# EAGLE design DC27-top (EAGLE 9.4.1)
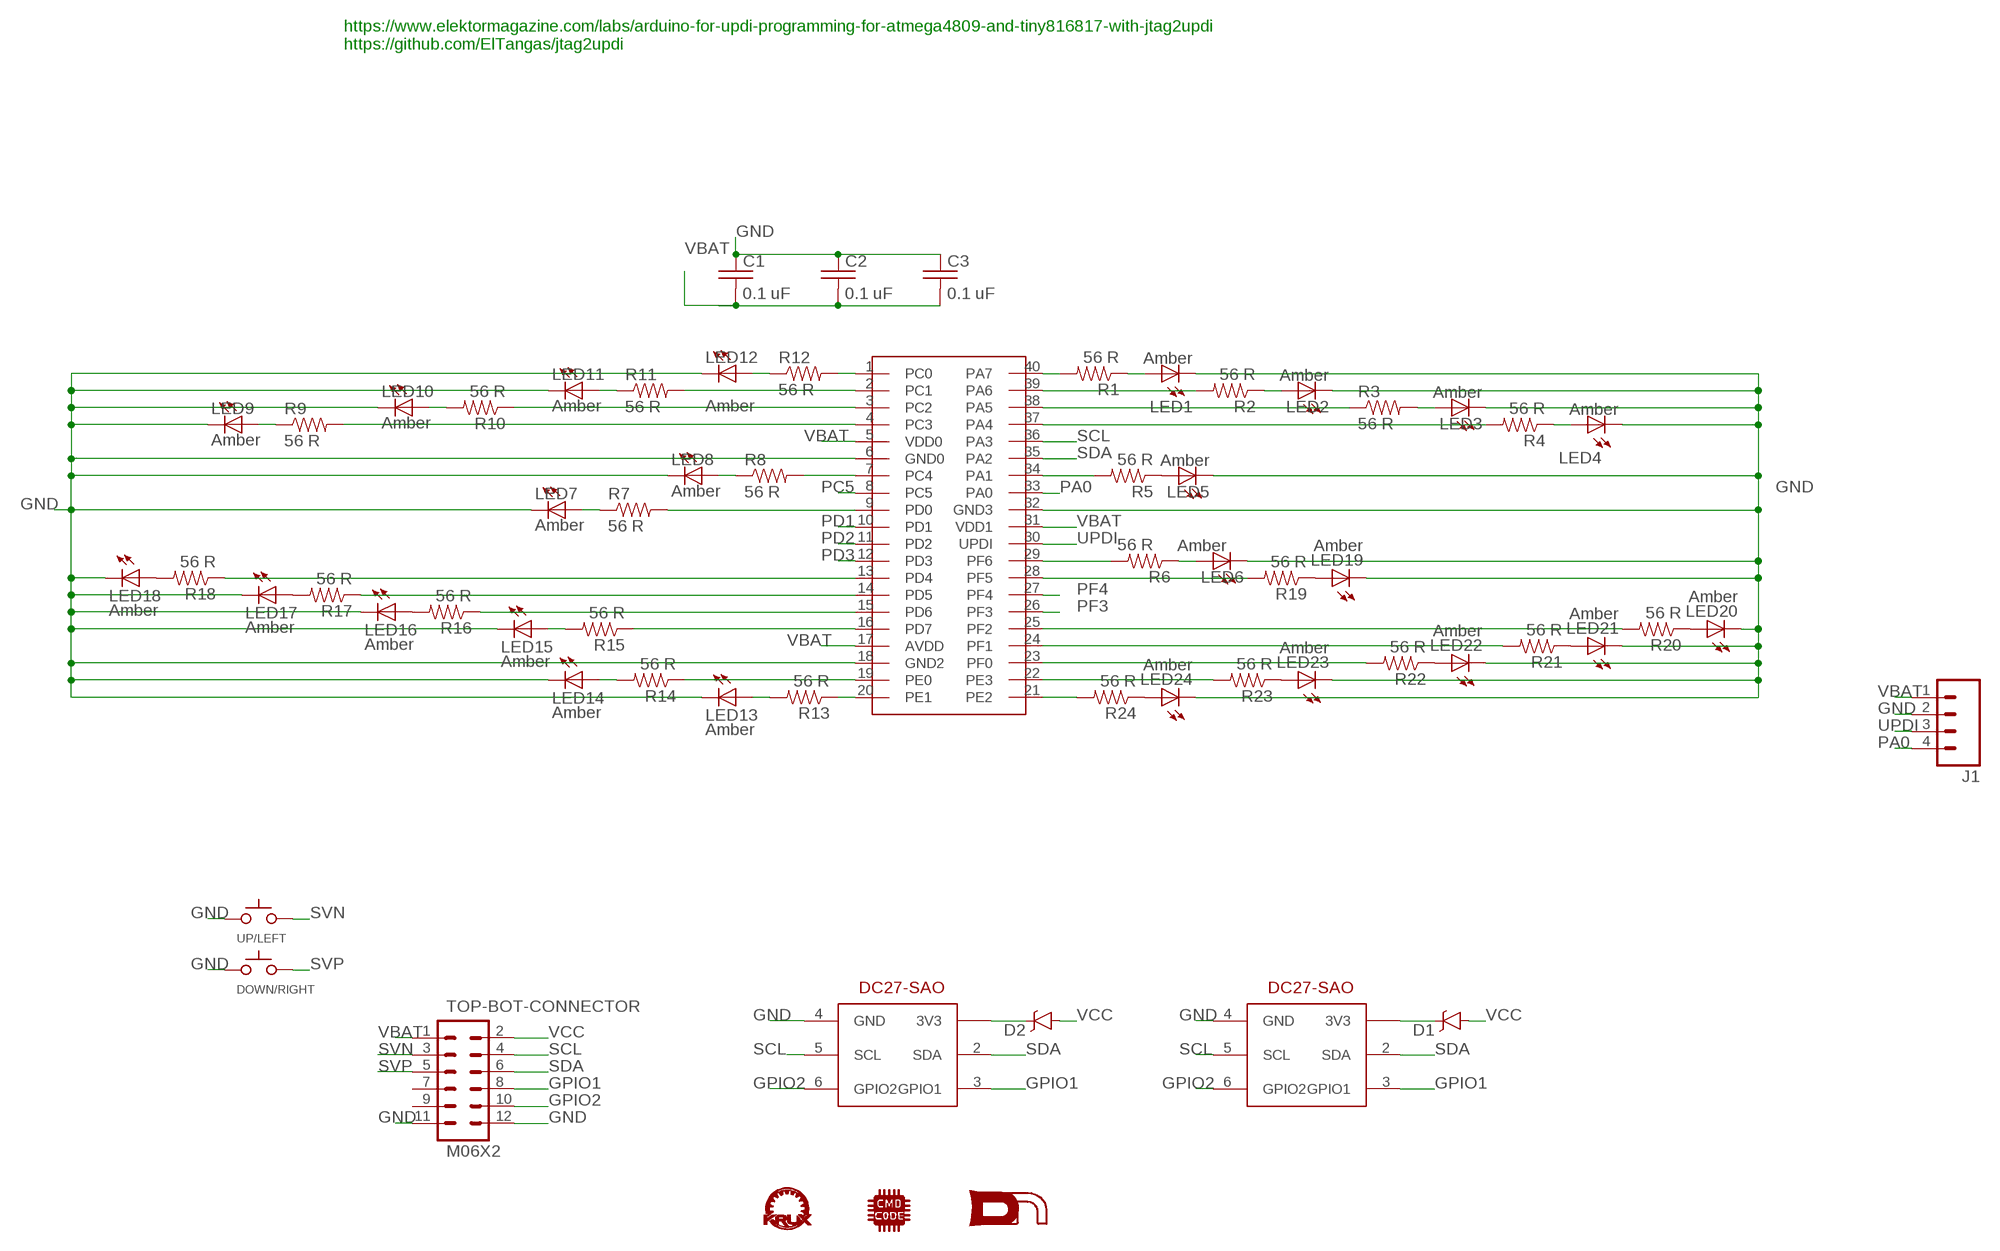
[diagram p0: schematic, sheet 1]

## Parts
C1  0.1 uF  C-USC1206  [C1206]
C2  0.1 uF  C-USC1206  [C1206]
C3  0.1 uF  C-USC1206  [C1206]
D1  DIODE-SCHOTTKYDIOAD-TH  [DIOAD1060W80L520D270]
D2  DIODE-SCHOTTKYDIOAD-TH  [DIOAD1060W80L520D270]
DOWN/RIGHT  SWITCH_TACTILETACTILE-2PIN-NARROW  [TACTILE-2PIN-NARROW]
J1  M04PTH  [1X04]
LED1  Amber  LEDREVERSEMOUNT  [GULLWING_LED]
LED2  Amber  LEDREVERSEMOUNT  [GULLWING_LED]
LED3  Amber  LEDREVERSEMOUNT  [GULLWING_LED]
LED4  Amber  LEDREVERSEMOUNT  [GULLWING_LED]
LED5  Amber  LEDREVERSEMOUNT  [GULLWING_LED]
LED6  Amber  LEDREVERSEMOUNT  [GULLWING_LED]
LED7  Amber  LEDREVERSEMOUNT  [GULLWING_LED]
LED8  Amber  LEDREVERSEMOUNT  [GULLWING_LED]
LED9  Amber  LEDREVERSEMOUNT  [GULLWING_LED]
LED10  Amber  LEDREVERSEMOUNT  [GULLWING_LED]
LED11  Amber  LEDREVERSEMOUNT  [GULLWING_LED]
LED12  Amber  LEDREVERSEMOUNT  [GULLWING_LED]
LED13  Amber  LEDREVERSEMOUNT  [GULLWING_LED]
LED14  Amber  LEDREVERSEMOUNT  [GULLWING_LED]
LED15  Amber  LEDREVERSEMOUNT  [GULLWING_LED]
LED16  Amber  LEDREVERSEMOUNT  [GULLWING_LED]
LED17  Amber  LEDREVERSEMOUNT  [GULLWING_LED]
LED18  Amber  LEDREVERSEMOUNT  [GULLWING_LED]
LED19  Amber  LEDREVERSEMOUNT  [GULLWING_LED]
LED20  Amber  LEDREVERSEMOUNT  [GULLWING_LED]
LED21  Amber  LEDREVERSEMOUNT  [GULLWING_LED]
LED22  Amber  LEDREVERSEMOUNT  [GULLWING_LED]
LED23  Amber  LEDREVERSEMOUNT  [GULLWING_LED]
LED24  Amber  LEDREVERSEMOUNT  [GULLWING_LED]
R1  56 R  RESISTOR1206  [1206]
R2  56 R  RESISTOR1206  [1206]
R3  56 R  RESISTOR1206  [1206]
R4  56 R  RESISTOR1206  [1206]
R5  56 R  RESISTOR1206  [1206]
R6  56 R  RESISTOR1206  [1206]
R7  56 R  RESISTOR1206  [1206]
R8  56 R  RESISTOR1206  [1206]
R9  56 R  RESISTOR1206  [1206]
R10  56 R  RESISTOR1206  [1206]
R11  56 R  RESISTOR1206  [1206]
R12  56 R  RESISTOR1206  [1206]
R13  56 R  RESISTOR1206  [1206]
R14  56 R  RESISTOR1206  [1206]
R15  56 R  RESISTOR1206  [1206]
R16  56 R  RESISTOR1206  [1206]
R17  56 R  RESISTOR1206  [1206]
R18  56 R  RESISTOR1206  [1206]
R19  56 R  RESISTOR1206  [1206]
R20  56 R  RESISTOR1206  [1206]
R21  56 R  RESISTOR1206  [1206]
R22  56 R  RESISTOR1206  [1206]
R23  56 R  RESISTOR1206  [1206]
R24  56 R  RESISTOR1206  [1206]
TOP-BOT-CONNECTOR  M06X2  [2X6]
U$1  KRUX_LOGO  [KRUX_LOGO]
U$2  CMD_C0DE_LOGO  [CMD_C0DE_LOGO]
U$3  DC-27-SAO  [3X2]
U$4  DC-27-SAO  [3X2]
U$5  DN_LOGODC26  [DN_LOGO_DC26]
U$6  ATMEGA4809-PFATMEL4809-PF  [DIP1587W58P254L5175H635Q40B]
UP/LEFT  SWITCH_TACTILETACTILE-2PIN-NARROW  [TACTILE-2PIN-NARROW]

## Nets
GND: C1.1 C2.1 C3.1 DOWN/RIGHT.P$2(C) J1.2 LED1.C LED2.C LED3.C LED4.C LED5.C LED6.C LED7.C LED8.C LED9.C LED10.C LED11.C LED12.C LED13.C LED14.C LED15.C LED16.C LED17.C LED18.C LED19.C LED20.C LED21.C LED22.C LED23.C LED24.C TOP-BOT-CONNECTOR.11 TOP-BOT-CONNECTOR.12 U$3.4(GND) U$4.4(GND) U$6.6(GND0) U$6.18(GND2) U$6.32(GND3) UP/LEFT.P$2(C)
GPIO1: TOP-BOT-CONNECTOR.8 U$3.3(GPIO1) U$4.3(GPIO1)
GPIO2: TOP-BOT-CONNECTOR.10 U$3.6(GPIO2) U$4.6(GPIO2)
N$1: R9.2 U$6.4(PC3)
N$2: LED9.A R9.1
N$3: R8.2 U$6.7(PC4)
N$4: R7.2 U$6.9(PD0)
N$5: R1.2 U$6.40(PA7)
N$6: R2.2 U$6.39(PA6)
N$7: R3.1 U$6.38(PA5)
N$8: LED8.A R8.1
N$9: LED7.A R7.1
N$10: R10.1 U$6.3(PC2)
N$11: R11.2 U$6.2(PC1)
N$12: R12.2 U$6.1(PC0)
N$13: R4.2 U$6.37(PA4)
N$14: LED5.A R5.1
N$15: R5.2 U$6.34(PA1)
N$16: R13.1 U$6.20(PE1)
N$17: LED13.A R13.2
N$18: R14.1 U$6.19(PE0)
N$19: LED14.A R14.2
N$20: R15.1 U$6.16(PD7)
N$21: LED15.A R15.2
N$22: LED17.A R17.2
N$23: LED16.A R16.2
N$24: R18.1 U$6.13(PD4)
N$25: D2.C U$3.1(3V3)
N$26: D1.C U$4.1(3V3)
N$27: R6.2 U$6.29(PF6)
N$28: LED6.A R6.1
N$29: LED4.A R4.1
N$30: LED18.A R18.2
N$31: LED1.A R1.1
N$32: LED2.A R2.1
N$33: R17.1 U$6.14(PD5)
N$34: R16.1 U$6.15(PD6)
N$35: LED24.A R24.1
N$36: LED10.A R10.2
N$37: LED11.A R11.1
N$38: LED12.A R12.1
N$39: LED23.A R23.1
N$40: LED22.A R22.1
N$41: LED19.A R19.1
N$42: LED21.A R21.1
N$43: LED20.A R20.1
N$44: R19.2 U$6.28(PF5)
N$45: R20.2 U$6.25(PF2)
N$46: R21.2 U$6.24(PF1)
N$47: R22.2 U$6.23(PF0)
N$48: R23.2 U$6.22(PE3)
N$49: R24.2 U$6.21(PE2)
N$51: LED3.A R3.2
PA0: J1.4 U$6.33(PA0)
PC5: U$6.8(PC5)
PD1: U$6.10(PD1)
PD2: U$6.11(PD2)
PD3: U$6.12(PD3)
PF3: U$6.26(PF3)
PF4: U$6.27(PF4)
SCL: TOP-BOT-CONNECTOR.4 U$3.5(SCL) U$4.5(SCL) U$6.36(PA3)
SDA: TOP-BOT-CONNECTOR.6 U$3.2(SDA) U$4.2(SDA) U$6.35(PA2)
SVN: TOP-BOT-CONNECTOR.3 UP/LEFT.P$1(A)
SVP: DOWN/RIGHT.P$1(A) TOP-BOT-CONNECTOR.5
UPDI: J1.3 U$6.30(UPDI)
VBAT [5v]: C1.2 C2.2 C3.2 J1.1 TOP-BOT-CONNECTOR.1 U$6.5(VDD0) U$6.17(AVDD) U$6.31(VDD1)
VCC [vcc]: D1.A D2.A TOP-BOT-CONNECTOR.2
Unconnected: TOP-BOT-CONNECTOR.7 TOP-BOT-CONNECTOR.9

## Notes on the sheet
- https://www.elektormagazine.com/labs/arduino-for-updi-programming-for-atmega4809-and-tiny816817-with-jtag2updi
  https://github.com/ElTangas/jtag2updi

## Library data of the parts
C1-C3 = passives:C-US: CAPACITOR, American symbol
D1 D2 = passives:DIODE-SCHOTTKY
DOWN/RIGHT UP/LEFT = switches:SWITCH_TACTILE
J1 = connector:M04: Header 4 Standard 4-pin 0.1" header. Use with straight break away headers (SKU : PRT-00116), right angle break away headers (PRT-00553), swiss pins (PRT-00743), machine pins (PRT-00117), and female headers (PRT-00115). Molex polarized connector foot print use with SKU : PRT-08231 with associated crimp pins and housings. 1MM SMD Version SKU: PRT-10208; PROD_ID: CONN-09696
LED1-LED24 = leds:LED: LEDs Standard schematic elements and footprints for 5mm, 3mm, 1206, and 0603 sized LEDs. 5mm - Spark Fun Electronics SKU : COM-00529 (and others)
R1-R24 = passives:RESISTOR: Resistor Basic schematic elements and footprints for 0603, 1206, and PTH resistors.
TOP-BOT-CONNECTOR = connector:M06X2
U$1 = darknet_parts_library:KRUX_LOGO
U$2 = logos:CMD_C0DE_LOGO
U$3 U$4 = defcon:DC-27-SAO: DC27SAO device
U$5 = darknet_parts_library:DN_LOGO
U$6 = ICs:ATMEGA4809-PF: datasheet <https://www.microchip.com/wwwproducts/en/ATMEGA4809#datasheet-toggle>

## Net classes
1 vcc: width 0.203 mm, drill 0.8 mm, clearance 0.178 mm
2 5v: width 0.254 mm, drill 0.8 mm, clearance 0.178 mm

## Board
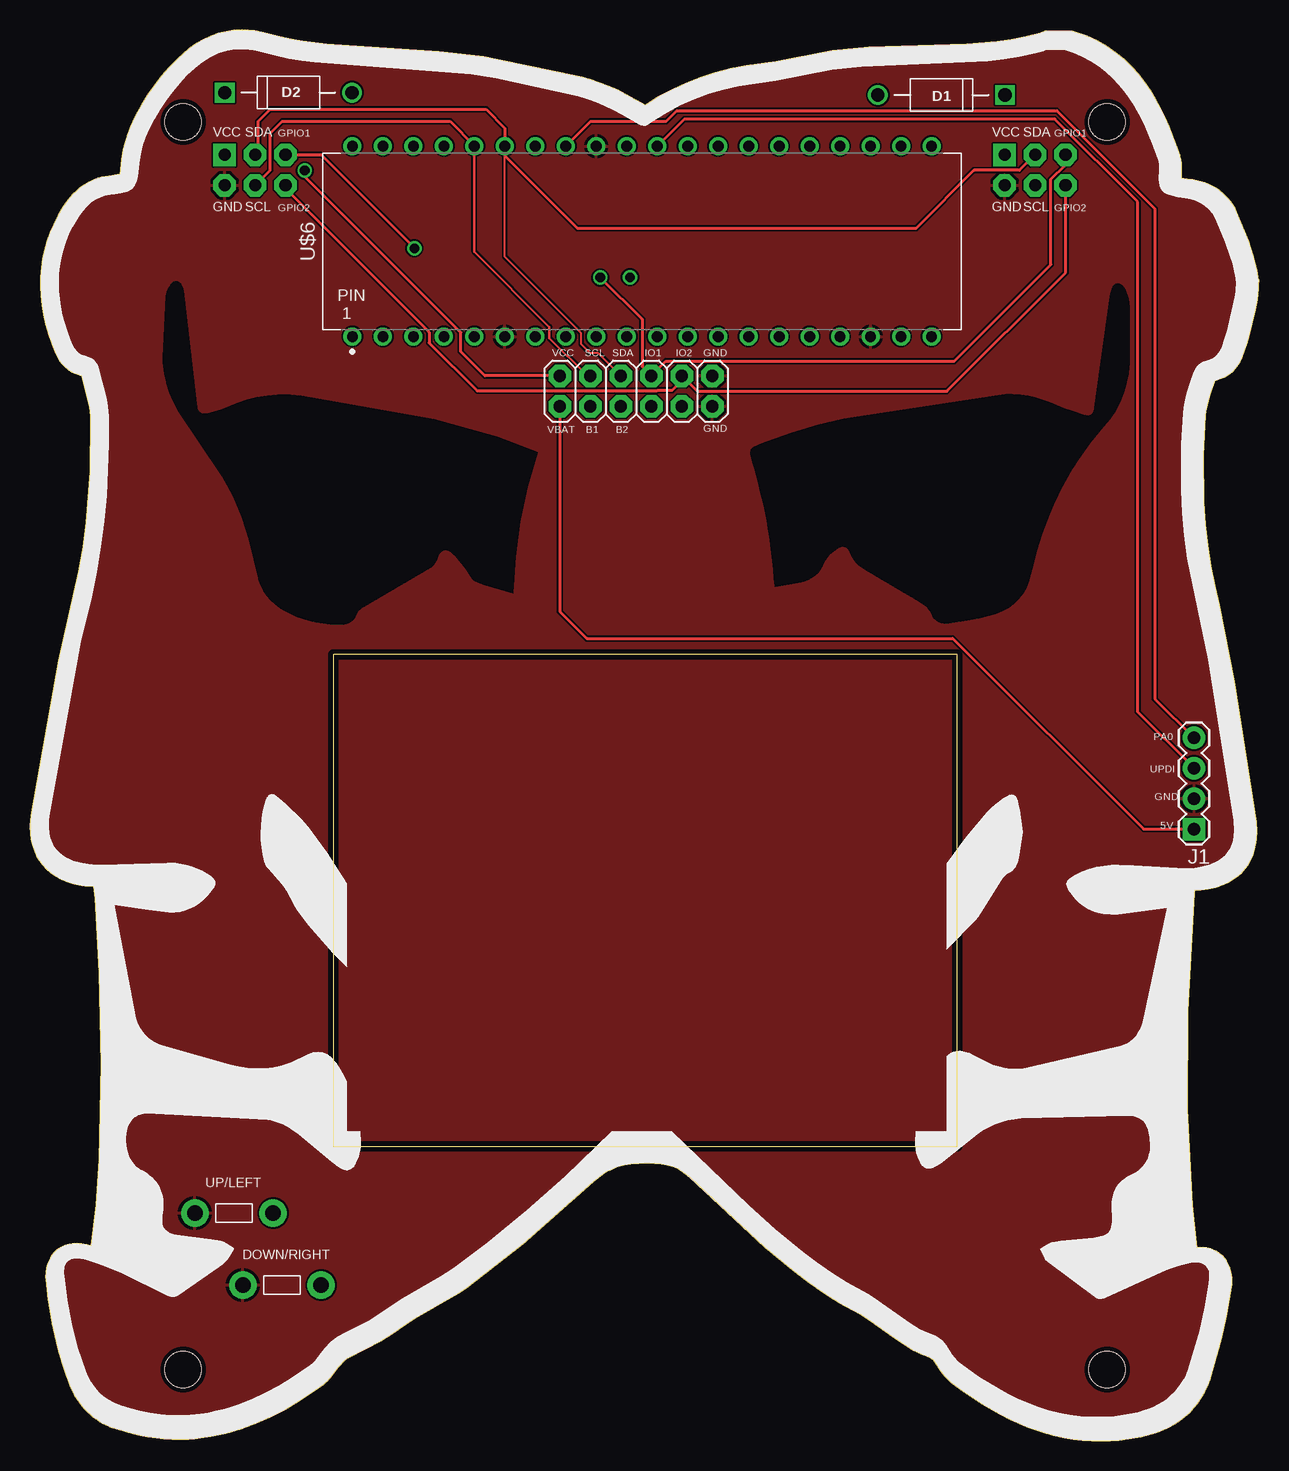
[diagram p1: board, top side]
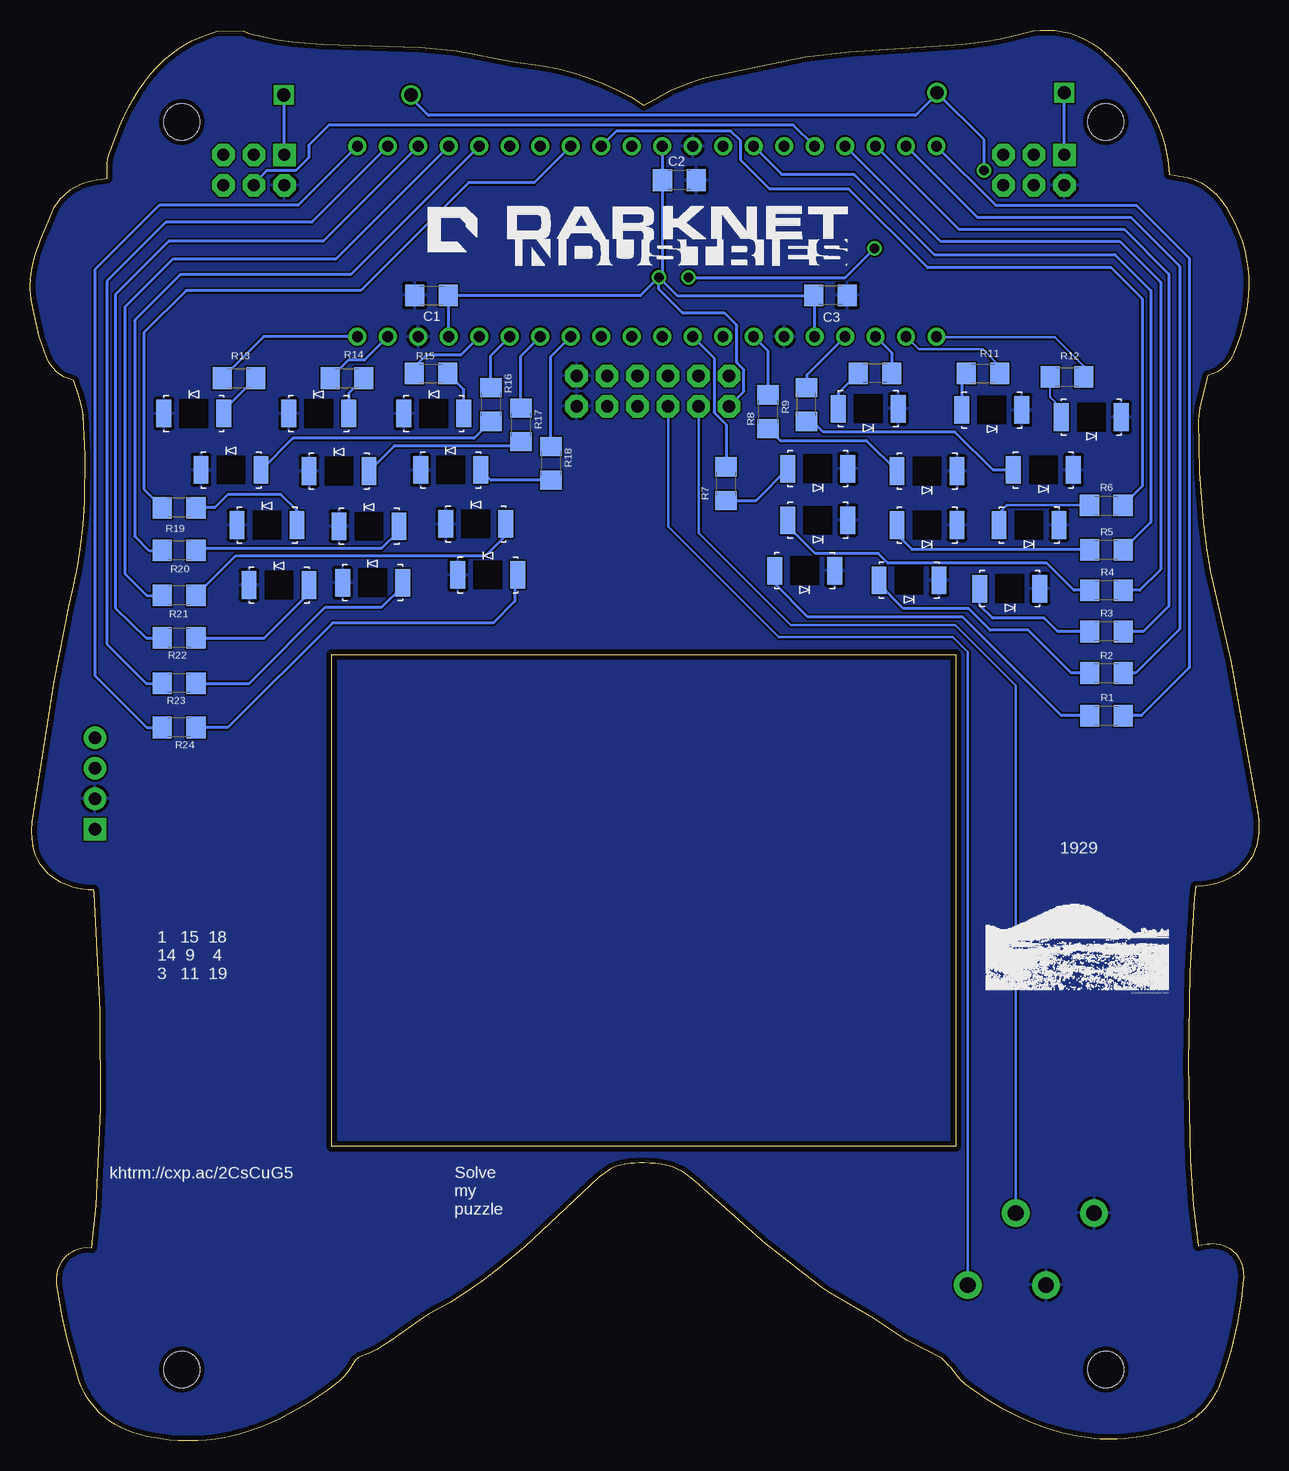
[diagram p2: board, bottom side, seen from below]

Size 102.41 x 117.62 mm. Coordinates in mm from the lower left corner, seen from the top.
Outline: 77.26,65.55 25.26,65.55 25.26,24.55 77.26,24.55 77.26,65.55
Outline: 102.39,96.81 102.37,97.03 102.27,97.62 102.12,98.24 101.95,98.86 101.55,100.05 100.57,102.45 100.42,102.75 100.25,103.03 100.07,103.29 99.87,103.54 99.66,103.78 99.42,103.99 99.18,104.19 99.05,104.29 98.78,104.46 98.5,104.62 98.21,104.76 97.9,104.88 97.58,104.98 97.25,105.06 96.91,105.12 96.46,105.17 96.17,105.23 95.97,105.28 95.99,106.07 95.98,106.3 95.96,106.54 95.93,106.79 95.87,107.04 95.84,107.17 94.92,109.59 94.59,110.35 94.22,111.11 93.83,111.85 93.39,112.57 92.91,113.27 92.39,113.94 91.81,114.58 91.18,115.18 90.49,115.74 89.74,116.25 88.92,116.72 88.03,117.12 86.84,117.53 84.64,117.56 84.2,117.35 82.99,117.05 81.77,116.82 80.55,116.65 78.06,116.45 69.91,116.17 66.85,115.88 62.15,114.97 59.68,114.63 58.38,114.37 57.11,114.05 55.87,113.66 54.67,113.19 53.51,112.65 52.37,112.04 51.26,111.36 49.68,112.25 48.92,112.62 48.18,112.95 47.45,113.24 46.72,113.49 46.01,113.7 37.82,115.38 34.1,115.82 24.71,116.44 22.73,116.67 21.76,116.83 20.79,117.04 19.29,117.44 18.75,117.54 18.21,117.6 17.67,117.62 17,117.59 16.34,117.49 15.69,117.33 15.05,117.11 14.43,116.81 13.83,116.46 13.24,116.05 12.3,115.22 11.6,114.52 10.95,113.77 10.34,113 9.78,112.18 9.26,111.34 8.79,110.46 8.36,109.55 8.09,108.88 7.84,108.05 7.75,107.64 7.61,106.81 7.46,105.58 7.03,105.5 6.58,105.45 6.27,105.4 5.96,105.33 5.66,105.25 5.37,105.14 5.09,105.02 4.81,104.88 4.55,104.72 4.29,104.55 4.04,104.36 3.8,104.15 3.57,103.92 3.35,103.68 3.13,103.42 2.93,103.14 2.73,102.84 2.33,102.15 1.97,101.45 1.67,100.74 1.41,100.02 1.2,99.29 1.04,98.55 0.93,97.79 0.86,97.03 0.85,96.26 0.89,95.48 0.97,94.69 1.1,93.89 1.29,93.08 1.52,92.27 1.8,91.44 2.13,90.61 2.27,90.34 2.44,90.06 2.65,89.79 2.9,89.54 3.17,89.31 3.48,89.11 3.81,88.96 4.28,88.82 4.86,86.53 4.93,86.16 4.98,85.8 5.02,85.44 5.04,85.09 4.99,80.76 4.66,76.57 4.38,74.51 4.04,72.48 2.35,65.05 0.1,52.4 0.03,51.77 0,51.21 0.02,50.67 0.08,50.15 0.19,49.67 0.34,49.21 0.53,48.77 0.77,48.37 1.04,48 1.36,47.66 1.72,47.36 2.11,47.09 2.55,46.85 3.02,46.65 3.53,46.49 4.07,46.36 4.56,46.28 5.27,46.22 5.4,45.26 5.75,39.06 5.91,31.41 5.73,23.43 5.47,19.68 5.07,16.28 4.78,16.35 4.33,16.43 4.11,16.45 3.9,16.46 3.54,16.44 3.21,16.38 2.92,16.3 2.67,16.19 2.44,16.06 2.25,15.92 2.08,15.78 1.95,15.63 1.81,15.46 1.67,15.26 1.55,15.02 1.44,14.74 1.35,14.42 1.3,14.06 1.29,13.66 1.29,13.44 1.49,11.83 1.82,9.8 2.31,7.63 2.63,6.52 3.01,5.4 3.22,4.84 3.37,4.49 3.53,4.15 3.7,3.83 3.89,3.52 4.09,3.23 4.3,2.95 4.53,2.69 4.76,2.44 5.01,2.21 5.27,1.99 5.55,1.79 5.83,1.61 6.12,1.44 6.43,1.29 6.75,1.16 7.07,1.05 7.77,0.83 8.46,0.65 9.15,0.49 9.83,0.37 10.5,0.27 11.16,0.2 11.82,0.15 12.72,0.14 13.23,0.16 13.73,0.19 14.23,0.25 15.11,0.38 15.73,0.51 16.35,0.65 17.59,1.02 18.83,1.47 20.06,2.02 21.3,2.66 22.54,3.4 23.78,4.23 24.49,4.75 24.65,4.88 24.8,5.02 24.93,5.17 25.06,5.31 25.69,6.13 25.79,6.24 26.25,6.71 26.44,6.88 26.53,6.94 29.26,8.37 30.07,8.87 32.08,10.22 35.69,12.31 36.4,12.78 41.11,16.43 46.97,21.63 47.94,22.37 48.15,22.5 48.38,22.61 48.63,22.73 48.9,22.83 49.21,22.92 49.54,23.01 50.05,23.09 50.3,23.12 50.73,23.16 51.2,23.18 51.65,23.17 52.06,23.15 52.4,23.12 53.05,23.02 53.55,22.88 53.96,22.71 54.13,22.61 54.45,22.41 55.01,21.97 61.19,16.19 63.53,14.25 64.78,13.3 66.08,12.39 67.45,11.53 69.13,10.59 69.62,10.29 72.29,8.39 73.22,7.79 73.52,7.62 73.82,7.46 74.13,7.31 74.46,7.17 74.9,7.01 75.04,6.95 75.16,6.87 75.26,6.76 75.37,6.63 75.89,5.83 76.05,5.61 76.23,5.39 76.42,5.17 76.63,4.97 76.75,4.88 77.69,4.18 79.3,3.11 80.87,2.21 81.64,1.81 82.4,1.46 83.16,1.15 83.92,0.88 84.67,0.64 85.42,0.44 86.17,0.28 86.92,0.16 87.68,0.07 88.44,0.02 89.37,0 90.06,0.02 90.75,0.07 91.8,0.2 92.62,0.36 93.23,0.51 93.81,0.69 94.36,0.9 94.88,1.14 95.36,1.4 95.82,1.7 96.24,2.02 96.63,2.37 96.99,2.75 97.32,3.16 97.62,3.6 97.89,4.07 98.13,4.56 98.34,5.09 99.33,8.51 99.73,10.41 100.11,12.58 100.17,13.08 100.18,13.51 100.15,13.89 100.08,14.23 99.98,14.53 99.87,14.79 99.74,15.01 99.6,15.2 99.39,15.43 99.12,15.65 98.91,15.79 98.66,15.91 98.39,16.01 98.07,16.08 97.72,16.12 97.28,16.11 96.88,19.66 96.5,27.66 96.54,35.83 97.04,45.67 97.1,45.92 97.57,45.95 98.2,46.03 98.8,46.16 99.35,46.34 99.85,46.56 100.32,46.83 100.74,47.15 100.93,47.33 101.28,47.72 101.51,48.03 101.72,48.4 101.92,48.83 102.08,49.33 102.2,49.89 102.24,50.2 102.26,50.87 102.21,51.62 100.41,63.32 99.15,69.69 98.77,71.29 98.44,72.94 98.18,74.64 97.99,76.41 97.86,78.24 97.82,82.14 97.97,85.48 98.02,85.83 98.09,86.19 98.17,86.55 98.39,87.3 98.76,88.4 99.18,88.54 99.56,88.7 99.9,88.91 100.21,89.15 100.49,89.43 100.73,89.75 100.83,89.93 101.02,90.3 101.44,91.48 101.62,92.07 102.15,94.33 102.31,95.16 102.37,95.59 102.4,96.03 102.41,96.36 102.41,96.58 102.39,96.81
Copper layers (1*16): Top 0.035559375mm / dielectric 1.6mm / Bottom 0.035559375mm
Design rules "oshpark-2layer": minimum track width 6mil, minimum drill 10mil, track to track 6mil, track to pad 6mil, pad to pad 6mil, via to via 6mil, smd to smd 6mil, copper to edge 15mil, drill to drill 6mil, minimum pad ring 5mil, minimum via ring 5mil, stop-mask expansion 2.5mil, vias tented up to drill 0mil, thermal gap 10mil
Holes 3 mm at 12.76,5.95 89.76,5.95 89.76,109.95 12.76,109.95
tRestrict: area 11.1,68.1 to 42.3,96.6; area 60,68.2 to 91.7,96.5

### Footprints (pad centres in the part's own frame; a part is rotated, then mirrored left to right if it is on the bottom)
C1206 = smd 1.6 x 1.8: 1 -1.4,0; 2 1.4,0
DIOAD1060W80L520D270 = drill 1.1 pad 1.65: A 5.3,0 | drill 1.1 pad 1.65 square: C -5.3,0
TACTILE-2PIN-NARROW = drill 1.3 pad 2.3: P$1 3.264,0; P$2 -3.264,0
1X04 = drill 1.016 pad 1.88 square: 1 0,0 | drill 1.016 pad 1.88: 2 2.54,0; 3 5.08,0; 4 7.62,0
GULLWING_LED = smd 1.245 x 2.3: A 5,-1.5; C 0,-1.5
1206 = smd 1.6 x 1.8: 1 -1.4,0; 2 1.4,0
2X6 = drill 1.016 pad 1.88 octagon: 1 0,0; 2 0,2.54; 3 2.54,0; 4 2.54,2.54; 5 5.08,0; 6 5.08,2.54; 7 7.62,0; 8 7.62,2.54; 9 10.16,0; 10 10.16,2.54; 11 12.7,0; 12 12.7,2.54
3X2 = drill 1.016 pad 1.88 square: 1 -2.54,1.27 | drill 1.016 pad 1.88 octagon: 2 0,1.27; 3 2.54,1.27; 4 -2.54,-1.27; 5 0,-1.27; 6 2.54,-1.27
DIP1587W58P254L5175H635Q40B = drill 0.894 pad 1.494: 1 -7.938,24.13; 2 -7.938,21.59; 3 -7.938,19.05; 4 -7.938,16.51; 5 -7.938,13.97; 6 -7.938,11.43; 7 -7.938,8.89; 8 -7.938,6.35; 9 -7.938,3.81; 10 -7.938,1.27; 11 -7.938,-1.27; 12 -7.938,-3.81; 13 -7.938,-6.35; 14 -7.938,-8.89; 15 -7.938,-11.43; 16 -7.938,-13.97; 17 -7.938,-16.51; 18 -7.938,-19.05; 19 -7.938,-21.59; 20 -7.938,-24.13; 21 7.938,-24.13; 22 7.938,-21.59; 23 7.938,-19.05; 24 7.938,-16.51; 25 7.938,-13.97; 26 7.938,-11.43; 27 7.938,-8.89; 28 7.938,-6.35; 29 7.938,-3.81; 30 7.938,-1.27; 31 7.938,1.27; 32 7.938,3.81; 33 7.938,6.35; 34 7.938,8.89; 35 7.938,11.43; 36 7.938,13.97; 37 7.938,16.51; 38 7.938,19.05; 39 7.938,21.59; 40 7.938,24.13

### Placement (x,y rotation side)
C1  68.95,95.5 0 bottom
C2  48.3,105.1 180 bottom
C3  35.7,95.5 180 bottom
D1  75.96,112.2 180 top
D2  21.53,112.4 0 top
DOWN/RIGHT  21,13 0 top
J1  97,51 90 top
LED1  35.36,71.05 180 bottom
LED2  26.66,70.25 180 bottom
LED3  18.26,69.55 180 bottom
LED4  34.26,75.25 180 bottom
LED5  25.16,74.85 180 bottom
LED6  16.66,74.85 180 bottom
LED7  34.26,79.55 180 bottom
LED8  25.16,79.35 180 bottom
LED9  15.46,79.45 180 bottom
LED10  30.06,84.55 180 bottom
LED11  19.76,84.45 180 bottom
LED12  11.46,83.85 180 bottom
LED13  91.26,87.15 0 bottom
LED14  80.86,87.15 0 bottom
LED15  71.26,87.15 0 bottom
LED16  88.16,82.45 0 bottom
LED17  79.16,82.35 0 bottom
LED18  69.86,82.45 0 bottom
LED19  85.16,77.85 0 bottom
LED20  76.66,77.75 0 bottom
LED21  67.76,77.95 0 bottom
LED22  84.16,72.85 0 bottom
LED23  76.36,73.05 0 bottom
LED24  66.76,73.7 0 bottom
R1  12.7,60.47 0 bottom
R2  12.7,64.02 0 bottom
R3  12.7,67.48 180 bottom
R4  12.7,70.92 0 bottom
R5  12.7,74.3 0 bottom
R6  12.73,77.98 0 bottom
R7  44.4,79.8 90 bottom
R8  40.9,85.8 90 bottom
R9  37.7,86.4 90 bottom
R10  32,89 180 bottom
R11  23,89 0 bottom
R12  16,88.7 0 bottom
R13  85,88.6 0 bottom
R14  76,88.6 0 bottom
R15  69,89 0 bottom
R16  64,86.4 270 bottom
R17  61.5,84.7 270 bottom
R18  59,81.5 270 bottom
R19  89.98,77.8 180 bottom
R20  89.98,74.24 180 bottom
R21  89.98,70.49 180 bottom
R22  89.98,66.95 180 bottom
R23  89.98,63.16 180 bottom
R24  89.98,59.48 180 bottom
TOP-BOT-CONNECTOR  44.16,86.25 0 top
U$1  34.25,20.11 0 bottom
U$2  71.2,20.03 0 bottom
U$3  18.76,105.95 0 top
U$4  83.76,105.95 0 top
U$5  51.76,100.45 0 bottom
U$6  51,100 90 top
UP/LEFT  17,19 0 top

### Tracks (layer width: path | path; a pad name or v marks a point on that pad's centre or on a via)
GND
  pour Bottom: 51.26,111.38 52.36,112.04 53.46,112.63 54.66,113.19 55.87,113.66 57.1,114.05 58.38,114.38 59.68,114.63 62.15,114.97 66.85,115.88 69.97,116.18 78.07,116.45 80.53,116.66 81.76,116.82 82.97,117.05 84.2,117.35 84.63,117.56 86.84,117.54 88.02,117.13 88.94,116.7 89.77,116.24 90.47,115.75 91.19,115.17 91.79,114.58 92.39,113.93 92.91,113.26 93.43,112.5 93.8,111.9 94.26,111.03 94.59,110.35 94.91,109.61 95.28,108.62 95.83,107.16 95.93,106.75 95.97,106.42 95.99,106.24 95.97,105.27 96.18,105.23 96.48,105.18 96.95,105.11 97.26,105.06 97.59,104.98 98.07,104.82 98.54,104.6 98.81,104.44 99.08,104.27 99.44,103.99 99.7,103.73 99.95,103.45 100.13,103.22 100.25,103.05 100.43,102.73 100.58,102.43 100.7,102.13 100.99,101.44 101.56,100.05 101.97,98.8 102.12,98.23 102.27,97.56 102.37,96.97 102.39,96.81 102.41,96.56 102.4,96.03 102.36,95.56 102.3,95.15 102.14,94.29 101.62,92.08 101.42,91.43 101.01,90.28 100.8,89.86 100.49,89.44 100.2,89.13 99.87,88.89 99.52,88.69 99.18,88.55 98.77,88.4 98.37,87.25 98.17,86.58 98.06,86.13 97.96,85.43 97.81,82.08 97.86,78.18 97.99,76.33 98.21,74.4 98.34,73.57 98.45,72.9 98.78,71.24 99.16,69.62 100.16,64.55 100.42,63.29 102.1,52.3 102.22,51.56 102.26,50.77 102.24,50.18 102.19,49.83 102.07,49.29 101.92,48.8 101.71,48.37 101.44,47.95 101.24,47.67 100.92,47.32 100.73,47.16 100.31,46.83 99.86,46.57 99.3,46.32 98.75,46.15 98.17,46.03 97.55,45.95 97.09,45.92 97.04,45.65 96.51,35.88 96.5,30.49 96.97,19.75 97.4,16.11 97.69,16.12 98.09,16.09 98.41,16.01 98.65,15.92 98.91,15.79 99.15,15.64 99.4,15.41 99.62,15.18 99.87,14.81 100.1,14.19 100.15,13.83 100.18,13.47 100.16,13.04 100.1,12.57 99.71,10.29 99.31,8.44 98.34,5.08 98.12,4.52 97.89,4.07 97.31,3.15 96.99,2.76 96.67,2.4 96.23,2 95.82,1.69 95.28,1.35 94.86,1.12 94.38,0.9 93.84,0.7 93.24,0.51 92.6,0.36 91.83,0.21 90.71,0.08 89.73,0.01 89.25,0 88.29,0.03 87.65,0.06 86.96,0.15 86.2,0.28 85.55,0.41 84.92,0.58 83.97,0.85 83.14,1.15 81.8,1.73 80.84,2.22 79.29,3.12 77.67,4.2 76.77,4.85 76.41,5.18 76.2,5.42 75.9,5.8 75.43,6.53 75.28,6.74 75.14,6.88 74.99,6.98 74.88,7.02 74.48,7.16 74.07,7.33 73.73,7.5 73.2,7.8 72.22,8.42 69.61,10.29 69.07,10.62 67.5,11.51 66.07,12.39 64.75,13.32 64.11,13.81 63.49,14.28 61.23,16.15 54.95,22.02 54.42,22.43 53.96,22.72 53.5,22.9 53.02,23.03 52.42,23.11 51.95,23.16 51.68,23.18 50.96,23.17 50.6,23.16 50.11,23.11 49.53,23.01 49.18,22.92 48.61,22.73 47.94,22.38 46.93,21.61 41.07,16.41 36.38,12.77 35.62,12.26 32.08,10.22 29.3,8.38 26.53,6.95 26.29,6.76 25.68,6.13 25.05,5.31 24.75,4.98 24.5,4.77 23.78,4.22 22.6,3.44 21.22,2.62 20.5,2.24 20.03,2 18.83,1.47 17.6,1.02 16.35,0.65 15.71,0.51 15.11,0.39 14.4,0.28 13.68,0.19 13.05,0.15 12.76,0.14 11.71,0.15 11.05,0.21 10.44,0.28 9.85,0.37 9.11,0.5 8.46,0.65 7.78,0.83 7.08,1.04 6.68,1.18 6.41,1.3 6.06,1.47 5.74,1.66 5.49,1.83 5.2,2.05 4.03,3.3 3.9,3.5 3.7,3.82 3.48,4.23 3.19,4.89 2.62,6.52 2.29,7.7 1.81,9.83 1.47,11.91 1.29,13.47 1.27,13.68 1.3,14.09 1.35,14.45 1.43,14.75 1.57,15.07 1.68,15.29 1.83,15.52 2.07,15.78 2.41,16.05 2.69,16.21 2.96,16.31 3.22,16.39 3.53,16.44 3.91,16.46 4.33,16.44 4.81,16.35 5.07,16.29 5.48,19.75 5.73,23.44 5.91,31.56 5.75,39.21 5.4,45.24 5.27,46.23 4.94,46.25 4.55,46.29 4.05,46.36 3.51,46.49 2.99,46.66 2.49,46.88 2.08,47.1 1.69,47.37 1.31,47.72 1.02,48.03 0.76,48.39 0.51,48.81 0.32,49.25 0.17,49.72 0.07,50.19 0.01,50.73 0,51.2 0.03,51.81 0.1,52.4 2.34,65.11 4.07,72.55 4.67,76.7 4.98,80.87 5.05,85.49 4.85,86.57 4.29,88.82 3.77,88.96 3.48,89.11 3.15,89.32 2.87,89.56 2.65,89.79 2.43,90.07 2.26,90.35 2.11,90.64 1.77,91.52 1.52,92.26 1.28,93.1 1.1,93.87 0.97,94.7 0.88,95.49 0.84,96.3 0.86,97.1 0.93,97.81 1.03,98.55 1.2,99.28 1.42,100.05 1.67,100.75 1.98,101.47 2.33,102.16 2.73,102.85 2.89,103.08 3.13,103.42 3.31,103.64 3.6,103.95 3.84,104.18 4.06,104.38 4.3,104.56 4.52,104.71 4.8,104.88 5.1,105.03 5.36,105.14 5.66,105.25 5.95,105.33 6.28,105.41 6.59,105.46 7.04,105.5 7.46,105.58 7.61,106.85 7.75,107.67 7.84,108.1 8.09,108.88 8.36,109.58 8.79,110.47 9.25,111.34 9.78,112.19 10.34,113 10.95,113.78 11.59,114.51 12.28,115.21 13.23,116.04 13.83,116.47 14.46,116.83 15.06,117.11 15.69,117.34 16.33,117.49 17,117.59 17.68,117.62 18.2,117.6 18.75,117.54 19.3,117.44 20.8,117.04 21.75,116.83 22.72,116.67 24.76,116.44 34.13,115.82 37.87,115.37 46.07,113.69 46.67,113.51 47.49,113.23 48.23,112.94 48.95,112.62 49.7,112.25 50.96,111.52
  pour Top: 51.26,111.38 52.37,112.04 53.46,112.63 54.66,113.19 55.87,113.66 57.1,114.05 58.38,114.38 59.68,114.63 62.15,114.97 66.85,115.88 69.97,116.18 78.07,116.45 80.53,116.66 81.76,116.82 82.97,117.05 84.2,117.35 84.63,117.56 86.84,117.54 88.02,117.13 88.94,116.7 89.77,116.24 90.48,115.75 91.2,115.17 91.8,114.58 92.39,113.93 92.91,113.26 93.43,112.5 93.8,111.9 94.26,111.03 94.59,110.35 94.91,109.61 95.28,108.62 95.84,107.16 95.93,106.75 95.97,106.42 95.99,106.24 95.98,105.27 96.19,105.23 96.48,105.18 96.95,105.11 97.26,105.06 97.59,104.98 98.07,104.82 98.54,104.6 98.82,104.44 99.08,104.27 99.44,103.99 99.7,103.73 99.95,103.45 100.13,103.21 100.25,103.05 100.43,102.73 100.58,102.43 100.7,102.13 100.99,101.44 101.56,100.05 101.97,98.8 102.12,98.22 102.27,97.56 102.38,96.97 102.39,96.81 102.41,96.56 102.4,96.03 102.36,95.56 102.31,95.15 102.14,94.29 101.62,92.08 101.43,91.43 101.01,90.28 100.8,89.86 100.49,89.44 100.2,89.13 99.87,88.89 99.52,88.68 99.18,88.54 98.77,88.4 98.37,87.25 98.17,86.58 98.06,86.13 97.96,85.43 97.81,82.08 97.86,78.17 97.99,76.32 98.21,74.4 98.34,73.57 98.45,72.9 98.78,71.24 99.17,69.62 100.17,64.55 100.42,63.29 102.1,52.3 102.22,51.56 102.26,50.77 102.24,50.18 102.19,49.83 102.07,49.29 101.92,48.8 101.72,48.37 101.44,47.95 101.24,47.67 100.92,47.32 100.73,47.15 100.31,46.83 99.86,46.57 99.3,46.32 98.75,46.15 98.17,46.03 97.55,45.95 97.09,45.92 97.04,45.65 96.51,35.88 96.5,30.49 96.97,19.75 97.4,16.11 97.69,16.12 98.09,16.09 98.41,16.01 98.65,15.92 98.92,15.79 99.15,15.64 99.4,15.41 99.62,15.17 99.87,14.81 100.1,14.19 100.16,13.83 100.18,13.47 100.16,13.04 100.11,12.57 99.71,10.29 99.31,8.44 98.34,5.08 98.12,4.52 97.89,4.07 97.32,3.15 96.99,2.75 96.67,2.4 96.23,2 95.82,1.69 95.28,1.35 94.86,1.12 94.38,0.9 93.84,0.7 93.25,0.51 92.6,0.36 91.83,0.21 90.72,0.07 89.73,0.01 89.25,0 88.3,0.02 87.65,0.06 86.96,0.15 86.2,0.28 85.55,0.41 84.92,0.58 83.97,0.85 83.14,1.15 81.8,1.73 80.84,2.22 79.29,3.11 77.67,4.2 76.77,4.85 76.41,5.18 76.2,5.42 75.9,5.8 75.43,6.53 75.28,6.74 75.14,6.88 75,6.98 74.88,7.02 74.48,7.16 74.07,7.33 73.73,7.49 73.2,7.8 72.22,8.42 69.61,10.29 69.07,10.62 67.5,11.51 66.08,12.39 64.75,13.32 64.11,13.81 63.5,14.28 61.23,16.15 54.95,22.02 54.43,22.43 53.96,22.72 53.5,22.9 53.02,23.03 52.42,23.11 51.95,23.16 51.68,23.18 50.96,23.17 50.6,23.16 50.11,23.11 49.53,23 49.18,22.92 48.61,22.73 47.94,22.38 46.93,21.61 41.08,16.41 36.38,12.77 35.62,12.26 32.08,10.22 29.3,8.38 26.54,6.95 26.29,6.76 25.68,6.13 25.05,5.31 24.75,4.98 24.5,4.76 23.78,4.22 22.6,3.44 21.23,2.62 20.51,2.24 20.03,2 18.83,1.47 17.6,1.02 16.35,0.65 15.71,0.51 15.11,0.38 14.4,0.28 13.68,0.19 13.05,0.15 12.77,0.14 11.71,0.15 11.05,0.21 10.44,0.28 9.85,0.37 9.11,0.5 8.46,0.65 7.78,0.83 7.08,1.04 6.68,1.18 6.41,1.3 6.06,1.47 5.74,1.66 5.5,1.82 5.2,2.05 4.88,2.33 4.47,2.75 4.03,3.3 3.9,3.5 3.7,3.82 3.49,4.23 3.19,4.89 2.62,6.51 2.29,7.7 1.81,9.83 1.48,11.91 1.29,13.47 1.27,13.68 1.3,14.09 1.35,14.45 1.43,14.75 1.57,15.07 1.68,15.29 1.84,15.52 2.07,15.78 2.41,16.05 2.69,16.2 2.96,16.31 3.22,16.39 3.53,16.44 3.91,16.46 4.33,16.44 4.81,16.35 5.07,16.29 5.48,19.75 5.73,23.44 5.91,31.56 5.75,39.21 5.4,45.24 5.27,46.23 4.94,46.25 4.55,46.28 4.05,46.36 3.51,46.49 2.99,46.66 2.49,46.88 2.08,47.1 1.69,47.37 1.31,47.71 1.02,48.02 0.76,48.39 0.51,48.81 0.32,49.25 0.17,49.72 0.07,50.19 0.01,50.73 0,51.2 0.03,51.81 0.1,52.4 2.34,65.11 4.07,72.55 4.67,76.7 4.99,80.87 5.05,85.49 4.85,86.57 4.29,88.82 3.78,88.96 3.48,89.11 3.15,89.32 2.87,89.56 2.65,89.79 2.43,90.07 2.26,90.35 2.11,90.64 1.77,91.52 1.52,92.26 1.28,93.1 1.1,93.87 0.97,94.7 0.89,95.49 0.85,96.3 0.87,97.1 0.93,97.81 1.03,98.55 1.2,99.28 1.42,100.05 1.67,100.75 1.98,101.47 2.33,102.16 2.73,102.85 2.89,103.08 3.13,103.42 3.32,103.64 3.6,103.95 3.84,104.18 4.06,104.37 4.31,104.56 4.52,104.7 4.8,104.88 5.11,105.03 5.36,105.14 5.66,105.25 5.95,105.33 6.28,105.4 6.59,105.45 7.04,105.5 7.46,105.58 7.61,106.85 7.75,107.67 7.85,108.1 8.09,108.88 8.36,109.58 8.79,110.47 9.26,111.34 9.78,112.19 10.34,113 10.96,113.78 11.59,114.51 12.28,115.21 13.23,116.04 13.83,116.47 14.46,116.83 15.06,117.11 15.69,117.33 16.33,117.49 17,117.59 17.69,117.62 18.2,117.6 18.75,117.54 19.3,117.44 20.8,117.04 21.75,116.83 22.72,116.67 24.76,116.44 34.13,115.82 37.88,115.37 46.07,113.69 46.67,113.51 47.49,113.23 48.24,112.94 48.95,112.62 49.7,112.25 50.96,111.52
GPIO1  (via drill 0.8)
  Top 0.254: U$4.3 86.3,106.4 85.08,105.19 85.08,98.08 77,90 57.37,90 57.36,90.01 53,90.01 TOP-BOT-CONNECTOR.8 51,89.57 51,93.51 v47.52,96.98 | U$3.3 24.28,107.22 32.03,99.47 v32.03,99.42
  Bottom 0.254: v47.52,96.98 34.47,96.98 v32.03,99.42
GPIO2
  Top 0.254: U$3.6 21.3,104.38 33.26,92.42 33.26,91.54 37.26,87.55 52.26,87.55 52.31,87.6 53.5,87.6 54.32,88.42 TOP-BOT-CONNECTOR.10 55.61,87.5 76.4,87.5 86.3,97.4 U$4.6
N$1
  Bottom 0.254: U$6.4 37.7,88.85 R9.2
N$2
  Bottom 0.254: LED9.A 22.16,80.95 25.33,84.12 36.3,84.12 37.17,85 R9.1
N$3
  Bottom 0.254: R8.2 40.9,90.85 U$6.7
N$4
  Bottom 0.254: U$6.9 45.4,90.28 45.4,85.73 44.4,84.73 R7.2
N$5
  Bottom 0.254: U$6.40 21.93,103 10.22,103 5.8,98.58 5.8,64.47 9.8,60.47 R1.2
N$6
  Bottom 0.254: U$6.39 23.47,102 10.68,102 6.6,97.92 6.6,67.7 10.28,64.02 R2.2
N$7
  Bottom 0.254: U$6.38 25.01,101 11.22,101 7.5,97.28 7.5,69.6 9.62,67.48 R3.1
N$8
  Bottom 0.254: LED8.A 32.71,83.4 39.9,83.4 R8.1
N$9
  Bottom 0.254: R7.1 41.91,78.4 LED7.A
N$10
  Bottom 0.254: U$6.3 30.6,90.71 R10.1
N$11
  Bottom 0.203: U$6.2 28.35,91 23,91 21.6,89.6 R11.2
N$12
  Bottom 0.152: U$6.1 26.81,92
  Bottom 0.203: 26.81,92 17,92 14.6,89.6 R12.2
N$13
  Bottom 0.254: U$6.37 26.55,100 11.6,100 8.2,96.6 8.2,72.65 9.92,70.92 R4.2
N$14
  Bottom 0.254: R5.1 28.9,74.3 30.16,75.56 LED5.A
N$15
  Bottom 0.254: U$6.34 39.77,105.6 33.76,105.6 27.06,98.9 12,98.9 9,95.9 9,76.6 R5.2
N$16
  Bottom 0.254: U$6.20 82.94,92.06 R13.1
N$17
  Bottom 0.254: R13.2 86.26,85.94 LED13.A
N$18
  Bottom 0.254: U$6.19 74.55,90.1 75.9,90.1 R14.1
N$19
  Bottom 0.254: R14.2 75.86,87.34 LED14.A
N$20
  Bottom 0.254: U$6.16 66.53,90.5 69.4,90.5 70.4,89.5 R15.1
N$21
  Bottom 0.254: LED15.A 66.26,87.66 R15.2
N$22
  Bottom 0.254: R17.2 61.81,82.99 72.02,82.99 LED17.A
N$23
  Bottom 0.254: R16.2 65.4,83.6 80.51,83.6 LED16.A
N$24
  Bottom 0.254: R18.1 59,90.41 U$6.13
N$25
  Bottom 0.254: U$3.1 16.22,112.39 D2.C
N$26
  Bottom 0.254: U$4.1 81.22,112.16 D1.C
N$27
  Bottom 0.254: U$6.29 53.55,109.2 44,109.2 43.2,108.4 43.2,106.78 40.78,104.35 34.16,104.35 27.61,97.8 12.3,97.8 9.72,95.22 9.72,79.59 R6.2
N$28
  Bottom 0.254: LED6.A 21.66,77.34 21,78 R6.1
N$29
  Bottom 0.254: R4.1 15.42,70.92 17.68,73.18 30.92,73.18 31.72,73.98 36.97,73.98 39.26,76.27 LED4.A
N$30
  Bottom 0.254: R18.2 64.01,80.1 LED18.A
N$31
  Bottom 0.254: R1.1 16.47,60.47 24.7,68.7 37.6,68.7 40.36,71.46 LED1.A
N$32
  Bottom 0.254: R2.1 15.63,64.02 19.21,67.6 22.4,67.6 24.2,69.4 29.62,69.4 31.66,71.44 LED2.A
N$33
  Bottom 0.254: U$6.14 61.5,90.45 R17.1
N$34
  Bottom 0.254: U$6.15 64,90.49 R16.1
N$35
  Bottom 0.254: LED24.A 62,71.96 62,70 63.8,68.2 77.2,68.2 85.92,59.48 R24.1
N$36
  Bottom 0.254: R10.2 35.06,87.34 LED10.A
N$37
  Bottom 0.254: R11.1 24.76,88.64 LED11.A
N$38
  Bottom 0.152: LED12.A 16.46,86.06 17.4,87 R12.1
N$39
  Bottom 0.254: R23.1 84.14,63.16 77.8,69.5 73.1,69.5 71.36,71.24 LED23.A
N$40
  Bottom 0.254: LED22.A 79.16,70.67 82.88,66.95 R22.1
N$41
  Bottom 0.254: LED19.A 80.16,77.56 81.5,78.9 85.92,78.9 87.02,77.8 R19.1
N$42
  Bottom 0.254: R21.1 85.26,73.8 64.43,73.8 62.76,75.47 LED21.A
N$43
  Bottom 0.254: LED20.A 71.66,75.87 73.13,74.4 88.39,74.4 R20.1
N$44
  Bottom 0.254: U$6.28 60.39,104.9 65.86,104.9 74.86,95.9 89.4,95.9 92.93,92.37 92.93,79.35 R19.2
N$45
  Bottom 0.254: U$6.25 75.68,97.23 89.89,97.23 93.7,93.42 93.7,75.42 92.52,74.24 R20.2
N$46
  Bottom 0.254: U$6.24 76.95,98.5 90.52,98.5 94.5,94.52 94.5,72.33 92.67,70.49 R21.2
N$47
  Bottom 0.254: U$6.23 77.99,100 90.84,100 95.3,95.54 95.3,69.44 92.72,66.95 R22.2
N$48
  Bottom 0.254: U$6.22 78.93,101.6 91.08,101.6 96,96.68 96,66.44 92.72,63.16 R23.2
N$49
  Bottom 0.254: U$6.21 80.07,103 91.63,103 97,97.63 97,63.79 92.69,59.48 R24.2
N$51
  Bottom 0.254: R3.2 16.78,67.48 17.9,68.6 22.2,68.6 23.26,69.66 LED3.A
PA0
  Top 0.254: U$6.33 46.71,110 53,110 53.9,110.9 85.57,110.9 93.75,102.72 93.75,61.87 J1.4
SCL
  Top 0.2: U$6.36 37.03,99.12 43.29,92.87 43.29,91.95 46.44,88.79 TOP-BOT-CONNECTOR.4
  Top 0.254: U$3.5 20,105.92 20,109 21,110 35,110 37.03,107.97 U$6.36
  Bottom 0.254: U$6.36 38.79,109.7 77.5,109.7 79.2,108 79.2,106.96 80.26,105.9 82.7,105.9 83.76,104.84 U$4.5
SDA
  Top 0.152: U$6.35 39.57,98.72 45.93,92.37 45.93,91.45 46.69,90.69 47.34,90.69 TOP-BOT-CONNECTOR.6
  Top 0.254: U$3.2 19,107.46 19,110 20,111 38,111 39.57,109.43 U$6.35 39.57,107.14 45.61,101.1 73.84,101.1 78.66,105.92 82.46,105.92 U$4.2
SVN
  Bottom 0.2: UP/LEFT.P$1 20.26,62.96 25.3,68 39,68 46.7,75.7 TOP-BOT-CONNECTOR.3
SVP
  Bottom 0.2: DOWN/RIGHT.P$1 24.26,65.76 25.5,67 40,67 49.24,76.24 TOP-BOT-CONNECTOR.5
UPDI
  Top 0.254: U$6.30 54.53,110.2 85.4,110.2 92.3,103.3 92.3,60.78 J1.3
VBAT  (via drill 0.8)
  Top 0.254: TOP-BOT-CONNECTOR.1 44.16,69.16 46.41,66.91 76.89,66.91 92.8,51 J1.1
  Bottom 0.254: TOP-BOT-CONNECTOR.1 42.91,87.5 42.91,89.31 43.5,89.89 43.5,93 44.5,94 48,94 50,96 v50,97 | v50,97 51.54,95.46 67.48,95.46 C1.2 67.54,92.09 U$6.17 | v50,97 48.48,95.48 37.12,95.48 C3.2 37.03,95.43 U$6.5 | U$6.31 49.7,107.91 C2.2 49.7,97.3 v50,97
VCC  (via drill 0.8)
  Top 0.254: TOP-BOT-CONNECTOR.2 37.91,88.79 35.9,90.8 35.9,92.4 22.9,105.4 v22.9,105.9
  Bottom 0.254: v22.9,105.9 22.9,108.47 D2.A 26.83,112.27 28.6,110.5 69.21,110.5 70.66,111.95 D1.A

### Text on the board
tNames: VCC | SDA | GPIO1 | VCC | SDA | GPIO1 | GND | SCL | GPIO2 | GND | SCL | GPIO2 | PIN / 1 | VCC | SCL | SDA | IO1 | IO2 | GND | VBAT | B1 | B2 | GND | PA0 | UPDI | GND | 5V
bNames: 1929 | 1 15 18 / 14 9 4 / 3 11 19 | E:/MyStuff/dev/darknet/hill1.bmp | khtrm://cxp.ac/2CsCuG5 | Solve / my / puzzle
Document: SMD components should be on the bottom layer of this board